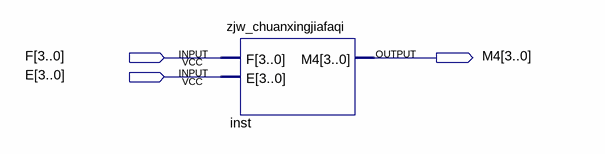
[diagram p0: schematic sheet]
// Quartus schematic Block1.bdf as structural Verilog: 1 symbols, 3 pins
module Block1 (
  input  [3:0] F,
  input  [3:0] E,
  output [3:0] M4
);

  zjw_chuanxingjiafaqi inst (.F(F), .E(E), .M4(M4));
endmodule
